# Altium schematic sheet Serial.SchDoc
size A4; SheetNumber: 7; SheetTotal: 10
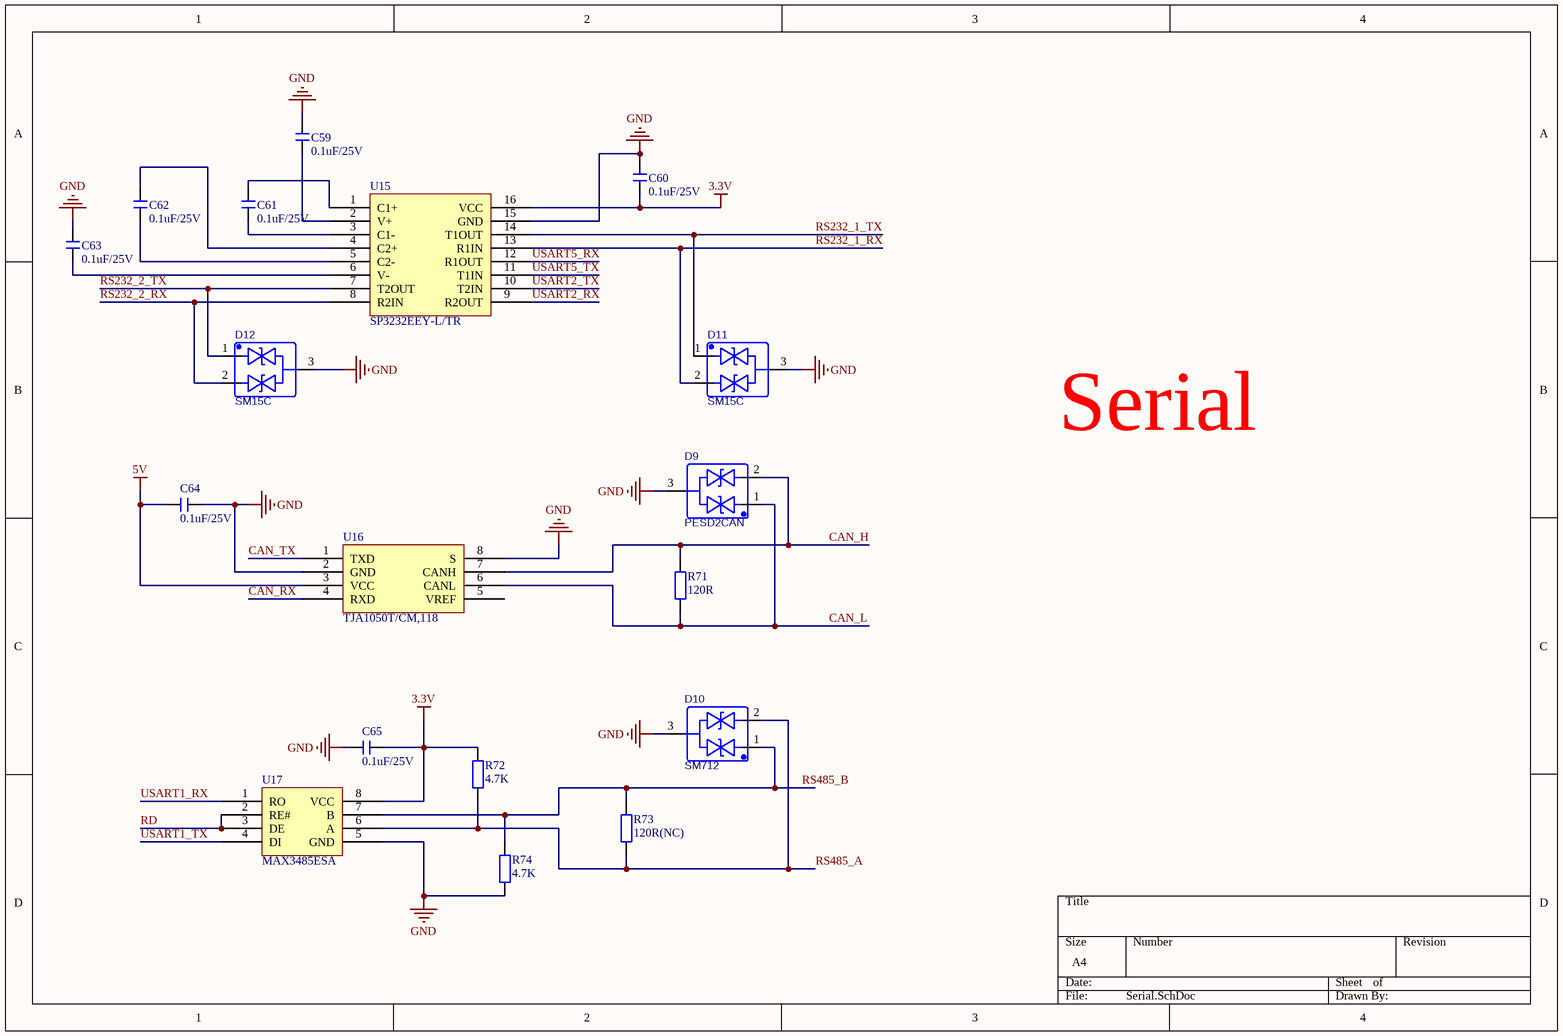
[diagram p0: Serial.SchDoc]

## Parts
C59  0.1uF/25V  [C 0603_L]
C60  0.1uF/25V  [C 0603_L]
C61  0.1uF/25V  [C 0603_L]
C62  0.1uF/25V  [C 0603_L]
C63  0.1uF/25V  [C 0603_L]
C64  0.1uF/25V  [C 0603_L]
C65  0.1uF/25V  [C 0603_L]
D9  PESD2CAN  [SOT23-3N]
D10  SM712  [SOT23-3N]
D11  SM15C  [SOT23-3N]
D12  SM15C  [SOT23-3N]
R71  120R  [R 0603_L]
R72  4.7K  [R 0603_L]
R73  120R(NC)  [R 0603_L]
R74  4.7K  [R 0603_L]
U15  SP3232EEY-L/TR  [TSSOP16_N]
U16  TJA1050T/CM,118  [SOP-8]
U17  MAX3485ESA  [SOP-8]

## Nets
3.3V: C60.1 C65.1 R72.2 U15.16(VCC) U17.8(VCC)
5V: C64.1 U16.3(VCC)
GND: C59.2 C60.2 C63.2 C64.2 C65.2 D9.3 D10.3 D11.3 D12.3 R74.1 U15.15(GND) U16.2(GND) U16.8(S) U17.5(GND)
CAN_H: D9.2 R71.2 U16.7(CANH)
CAN_L: D9.1 R71.1 U16.6(CANL)
CAN_RX: U16.4(RXD)
CAN_TX: U16.1(TXD)
RD: U17.2(RE#) U17.3(DE)
RS232_1_RX: D11.2 U15.13(R1IN)
RS232_1_TX: D11.1 U15.14(T1OUT)
RS232_2_RX: D12.2 U15.8(R2IN)
RS232_2_TX: D12.1 U15.7(T2OUT)
RS485_A: D10.2 R72.1 R73.1 U17.6(A)
RS485_B: D10.1 R73.2 R74.2 U17.7(B)
USART1_RX: U17.1(RO)
USART1_TX: U17.4(DI)
USART2_RX: U15.9(R2OUT)
USART2_TX: U15.10(T2IN)
USART5_RX: U15.12(R1OUT)
USART5_TX: U15.11(T1IN)
NetC59_1: C59.1 U15.2(V+)
NetC61_1: C61.1 U15.3(C1-)
NetC61_2: C61.2 U15.1(C1+)
NetC62_1: C62.1 U15.5(C2-)
NetC62_2: C62.2 U15.4(C2+)
NetC63_1: C63.1 U15.6(V-)

Not connected (* = marked no-connect by the designer): U16 5(VREF)

## Notes on the sheet
- Serial

## Library data of the parts
C59-C65 = C: 无极性贴片电容; 版权归属: 源创客; BOM名称: 无极性贴片电容; 学习资源: www.ooocke.com
D9-D12 = PESD2CAN: BOM_Manufacturer: DOWO; Contributor: LCSC; BOM_Supplier: LCSC; BOM_Supplier Part: C284078; BOM_Manufacturer Part: PESD2CAN; BOM_JLCPCB Part Class: Extended Part; spicePre: D; spiceSymbolName: PESD2CAN
R71-R74 = R: 贴片电阻; 版权归属: 源创客; BOM名称: 贴片电阻; 学习资源: www.ooocke.com